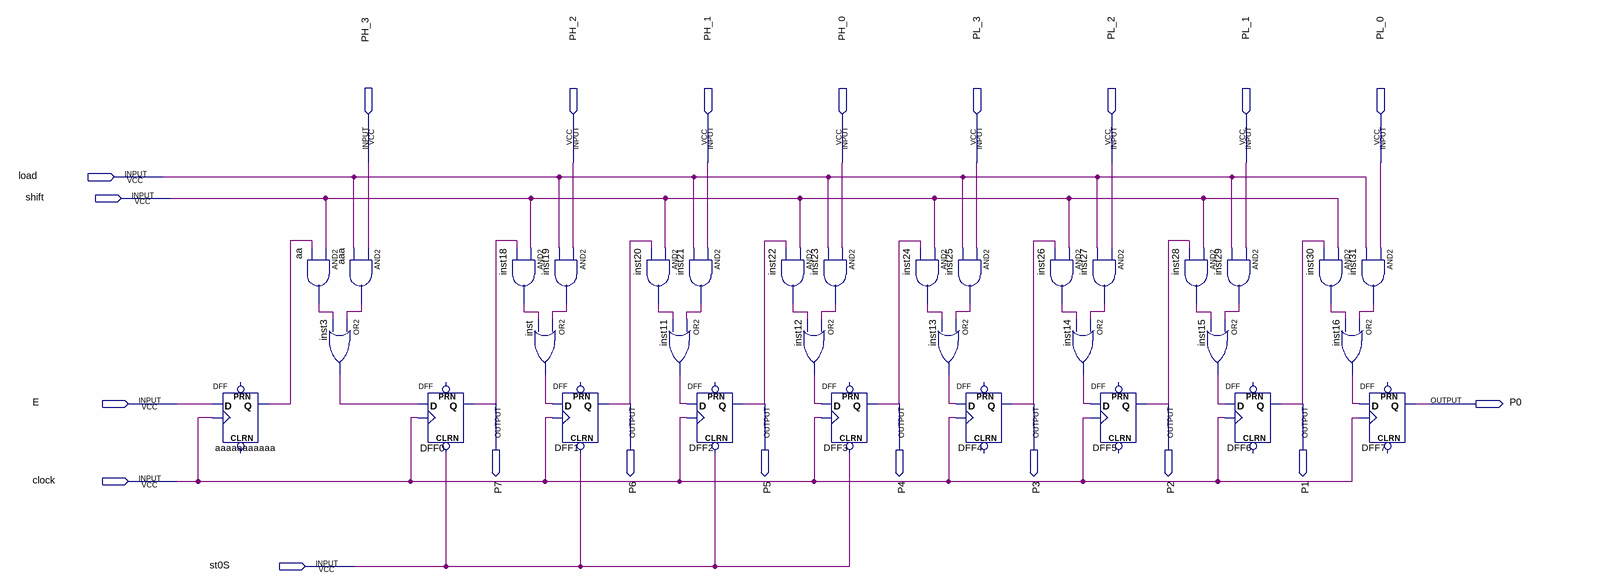
[diagram p0: schematic sheet]
// Quartus schematic PISO.bdf as structural Verilog: 33 symbols, 21 pins
module PISO (
  input  PH_3,
  input  PH_2,
  input  PH_1,
  input  PH_0,
  input  PL_3,
  input  PL_2,
  input  PL_1,
  input  PL_0,
  input  load,
  input  shift,
  input  E,
  input  clock,
  input  st0S,
  output P7,
  output P6,
  output P5,
  output P4,
  output P3,
  output P2,
  output P1,
  output P0
);

  wire aa_out, aaa_out, aaaaaaaaaaa_q, inst3_out, inst11_out, inst12_out, inst13_out, inst14_out, inst15_out,
       inst16_out, inst18_out, inst19_out, inst20_out, inst21_out, inst22_out, inst23_out, inst24_out,
       inst25_out, inst26_out, inst27_out, inst28_out, inst29_out, inst30_out, inst31_out, inst_out;

  DFF aaaaaaaaaaa (.CLK(clock), .D(E), .Q(aaaaaaaaaaa_q));  // open: CLRN, PRN
  and aa (aa_out, shift, aaaaaaaaaaa_q);
  or inst3 (inst3_out, aaa_out, aa_out);
  and aaa (aaa_out, PH_3, load);
  DFF DFF0 (.CLRN(st0S), .CLK(clock), .D(inst3_out), .Q(P7));  // open: PRN
  and inst18 (inst18_out, shift, P7);
  and inst19 (inst19_out, PH_2, load);
  or inst (inst_out, inst19_out, inst18_out);
  DFF DFF1 (.CLRN(st0S), .CLK(clock), .D(inst_out), .Q(P6));  // open: PRN
  and inst20 (inst20_out, shift, P6);
  or inst11 (inst11_out, inst21_out, inst20_out);
  and inst21 (inst21_out, PH_1, load);
  DFF DFF2 (.CLRN(st0S), .CLK(clock), .D(inst11_out), .Q(P5));  // open: PRN
  and inst22 (inst22_out, shift, P5);
  and inst23 (inst23_out, PH_0, load);
  or inst12 (inst12_out, inst23_out, inst22_out);
  DFF DFF3 (.CLRN(st0S), .CLK(clock), .D(inst12_out), .Q(P4));  // open: PRN
  and inst24 (inst24_out, shift, P4);
  and inst25 (inst25_out, PL_3, load);
  or inst13 (inst13_out, inst25_out, inst24_out);
  DFF DFF4 (.CLK(clock), .D(inst13_out), .Q(P3));  // open: CLRN, PRN
  and inst26 (inst26_out, shift, P3);
  or inst14 (inst14_out, inst27_out, inst26_out);
  and inst27 (inst27_out, PL_2, load);
  DFF DFF5 (.CLK(clock), .D(inst14_out), .Q(P2));  // open: CLRN, PRN
  and inst28 (inst28_out, shift, P2);
  and inst29 (inst29_out, PL_1, load);
  or inst15 (inst15_out, inst29_out, inst28_out);
  DFF DFF6 (.CLK(clock), .D(inst15_out), .Q(P1));  // open: CLRN, PRN
  and inst30 (inst30_out, shift, P1);
  and inst31 (inst31_out, PL_0, load);
  or inst16 (inst16_out, inst31_out, inst30_out);
  DFF DFF7 (.CLK(clock), .D(inst16_out), .Q(P0));  // open: CLRN, PRN
endmodule
